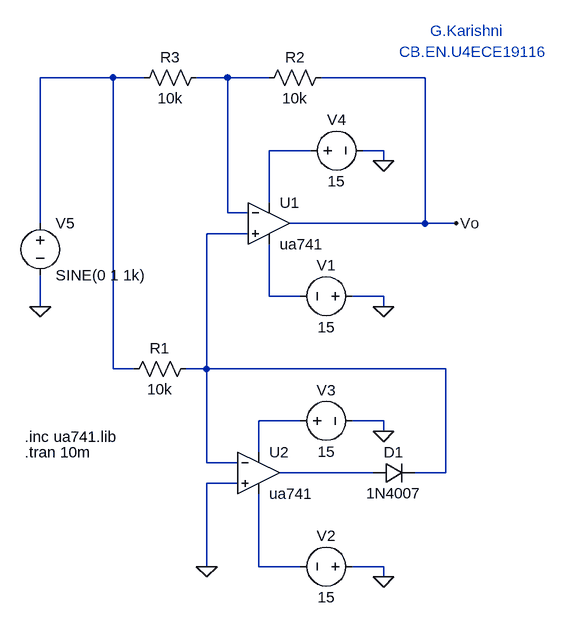
[diagram p0: schematic Draft_precision full wave rectifier.asc]
Draft_precision full wave rectifier.asc, the LTspice schematic file:
Version 4
SHEET 1 880 720
WIRE 0 -96 -112 -96
WIRE 48 -96 0 -96
WIRE 176 -96 128 -96
WIRE 240 -96 176 -96
WIRE 480 -96 320 -96
WIRE 304 16 240 16
WIRE 416 16 384 16
WIRE 416 32 416 16
WIRE 240 96 240 16
WIRE 176 112 176 -96
WIRE 208 112 176 112
WIRE -112 128 -112 -96
WIRE 480 128 480 -96
WIRE 480 128 272 128
WIRE 528 128 480 128
WIRE 208 144 144 144
WIRE 240 240 240 160
WIRE 288 240 240 240
WIRE 416 240 368 240
WIRE -112 256 -112 208
WIRE 416 256 416 240
WIRE 0 352 0 -96
WIRE 32 352 0 352
WIRE 144 352 144 144
WIRE 144 352 112 352
WIRE 512 352 144 352
WIRE 288 432 224 432
WIRE 416 432 368 432
WIRE 416 448 416 432
WIRE 224 480 224 432
WIRE 144 496 144 352
WIRE 192 496 144 496
WIRE 400 512 256 512
WIRE 512 512 512 352
WIRE 512 512 464 512
WIRE 192 528 144 528
WIRE 144 656 144 528
WIRE 224 656 224 544
WIRE 288 656 224 656
WIRE 416 656 368 656
WIRE 416 672 416 656
FLAG 416 32 0
FLAG 416 256 0
FLAG 416 448 0
FLAG 416 672 0
FLAG 144 656 0
FLAG -112 256 0
FLAG 528 128 Vo
SYMBOL OpAmps\\ua741 240 64 R0
SYMATTR InstName U1
SYMBOL OpAmps\\ua741 224 448 R0
SYMATTR InstName U2
SYMBOL res 336 -112 R90
WINDOW 0 0 56 VBottom 2
WINDOW 3 32 56 VTop 2
SYMATTR InstName R2
SYMATTR Value 10k
SYMBOL res 144 -112 R90
WINDOW 0 0 56 VBottom 2
WINDOW 3 32 56 VTop 2
SYMATTR InstName R3
SYMATTR Value 10k
SYMBOL res 128 336 R90
WINDOW 0 0 56 VBottom 2
WINDOW 3 32 56 VTop 2
SYMATTR InstName R1
SYMATTR Value 10k
SYMBOL voltage -112 112 R0
WINDOW 123 0 0 Left 0
WINDOW 39 0 0 Left 0
SYMATTR InstName V5
SYMATTR Value SINE(0 1 1k)
SYMBOL voltage 384 240 R90
WINDOW 0 -32 56 VBottom 2
WINDOW 3 32 56 VTop 2
WINDOW 123 0 0 Left 0
WINDOW 39 0 0 Left 0
SYMATTR InstName V1
SYMATTR Value 15
SYMBOL voltage 384 656 R90
WINDOW 0 -32 56 VBottom 2
WINDOW 3 32 56 VTop 2
WINDOW 123 0 0 Left 0
WINDOW 39 0 0 Left 0
SYMATTR InstName V2
SYMATTR Value 15
SYMBOL voltage 272 432 R270
WINDOW 0 32 56 VTop 2
WINDOW 3 -32 56 VBottom 2
WINDOW 123 0 0 Left 0
WINDOW 39 0 0 Left 0
SYMATTR InstName V3
SYMATTR Value 15
SYMBOL voltage 288 16 R270
WINDOW 0 32 56 VTop 2
WINDOW 3 -32 56 VBottom 2
WINDOW 123 0 0 Left 0
WINDOW 39 0 0 Left 0
SYMATTR InstName V4
SYMATTR Value 15
SYMBOL diode 400 528 R270
WINDOW 0 32 32 VTop 2
WINDOW 3 0 32 VBottom 2
SYMATTR InstName D1
SYMATTR Value 1N4007
TEXT -136 456 Left 2 !.inc ua741.lib
TEXT -136 480 Left 2 !.tran 10m
TEXT 488 -168 Left 2 ;G.Karishni
TEXT 440 -136 Left 2 ;CB.EN.U4ECE19116

The netlist it stands for:
* Draft_precision full wave rectifier.asc
XU1 N004 N002 N003 N005 Vo ua741  ; pins In+ In- V+ V- OUT
XU2 0 N004 N006 N008 N007 ua741  ; pins In+ In- V+ V- OUT
R2 Vo N002 10k
R3 N002 N001 10k
R1 N004 N001 10k
V5 N001 0 SINE(0 1 1k)
V1 0 N005 15
V2 0 N008 15
V3 N006 0 15
V4 N003 0 15
D1 N007 N004 1N4007
.model D D
.lib standard.dio
.inc ua741.lib
.tran 10m
* G.Karishni
* CB.EN.U4ECE19116
.backanno
.end